# EasyEDA Pro project MP9929-BUCK电路.epro

# Schematic mp9929
Board Name: mp9929; Create Date: 2025-10-21; Page Name: P1; Project Name: mp99291; Schematic Name: mp9929; Update Date: 2025-10-21; Company: 嘉立创EDA; Page Size: A4; Version: V1.0
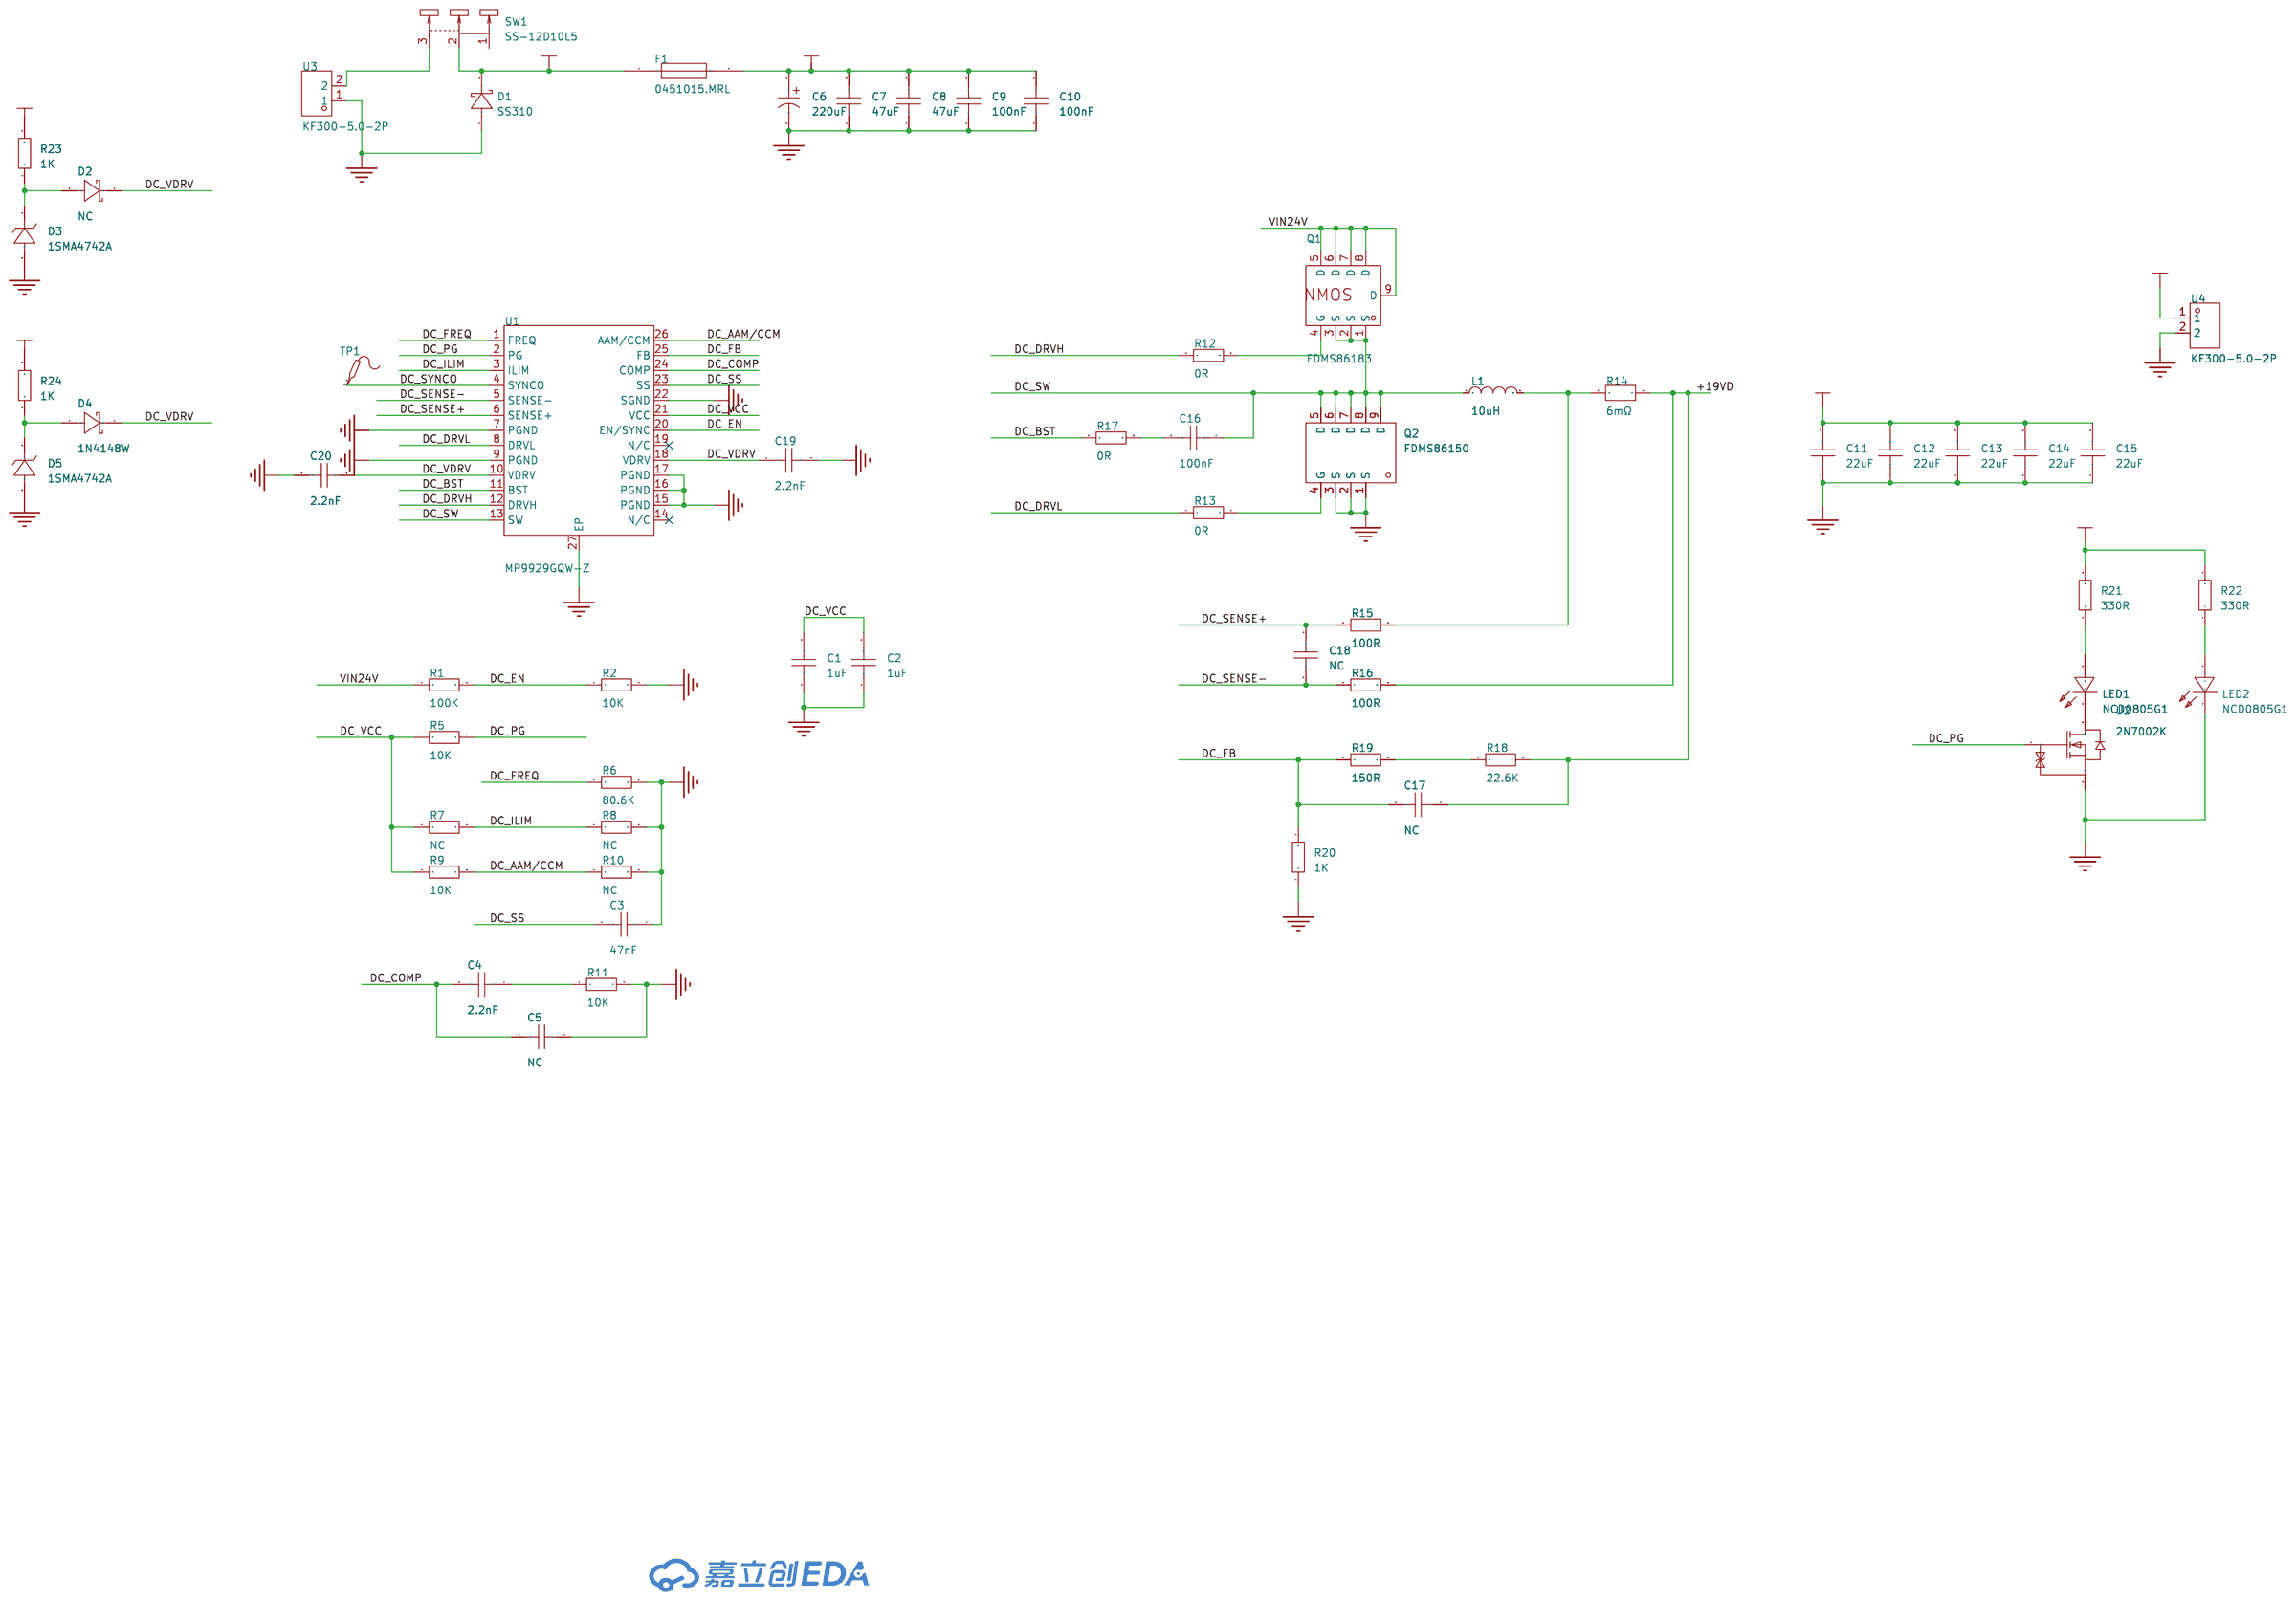
[diagram p0: schematic sheet]

## Parts
C1  1uF  [C0805]
C2  1uF  [C0805]
C3  47nF  [C0805]
C4  2.2nF  [C0805]
C5  NC  [C0805]
C6  220uF  [CAP-SMD_BD10.0-L10.3-W10.3-LS11.7-FD]
C7  47uF  [C1210]
C8  47uF  [C1210]
C9  100nF  [C0805]
C10  100nF  [C0805]
C11  22uF  [C1210]
C12  22uF  [C1210]
C13  22uF  [C1210]
C14  22uF  [C1210]
C15  22uF  [C1210]
C16  100nF  [C0805]
C17  NC  [C0805]
C18  NC  [C0805]
C19  2.2nF  [C0805]
C20  2.2nF  [C0805]
D1  SS310  [SMA_L4.3-W2.6-LS5.0-FD]
D2  NC  [SOD-123_L2.7-W1.6-LS3.7-FD]
D3  1SMA4742A  [SMA_L4.3-W2.6-LS5.0-RD]
D4  1N4148W  [SOD-123_L2.7-W1.6-LS3.7-FD]
D5  1SMA4742A  [SMA_L4.3-W2.6-LS5.0-RD]
F1  0451015.MRL  [FUSE-SMD_L6.1-W2.6]
L1  10uH  [IND-SMD_L11.5-W10.0_FXL1040]
LED1  NCD0805G1  [LED0805-R-RD]
LED2  NCD0805G1  [LED0805-R-RD]
Q1  FDMS86183  [POWER-56_L5.0-W6.0-P1.27-LS6.2-BL]
Q2  FDMS86150  [POWER-56_L5.0-W6.0-P1.27-LS6.2-BL]
R1  100K  [R0805]
R2  10K  [R0805]
R5  10K  [R0805]
R6  80.6K  [R0805]
R7  NC  [R0805]
R8  NC  [R0805]
R9  10K  [R0805]
R10  NC  [R0805]
R11  10K  [R0805]
R12  0R  [R0805]
R13  0R  [R0805]
R14  6mΩ  [RES-SMD_L6.4-W3.2-R2512]
R15  100R  [R0805]
R16  100R  [R0805]
R17  0R  [R0805]
R18  22.6K  [R0805]
R19  150R  [R0805]
R20  1K  [R0805]
R21  330R  [R0805]
R22  330R  [R0805]
R23  1K  [R0805]
R24  1K  [R0805]
SW1  SS-12D10L5  [SW-TH_SS-12D10L5]
TP1  -  [Test-Point-0.5mm]
U1  MP9929GQW-Z  [QFN-26_L6.0-W4.0-P0.50_MP9929GQW-Z]
U2  2N7002K  [SOT-23-3_L2.9-W1.3-P0.95-LS2.4-BR]
U3  KF300-5.0-2P  [CONN-TH_P5.00_KF300-5.0-2P]
U4  KF300-5.0-2P  [CONN-TH_P5.00_KF300-5.0-2P]

## Library data of the parts
C1-C5 C17 C19 C20 = CAP_0603: Supplier Footprint: 0603
C6 = JVJ50V220M10x10: 容值:220uF;精度:±20%;额定电压:50V;纹波电流:220mA@120Hz;; LCSC Part Name: 220uF ±20% 50V; Supplier Part: C46550417; Manufacturer: JIERR(捷而瑞); Supplier Footprint: SMD,D10xL10.5mm; JLCPCB Part Class: 扩展库; Datasheet: https://item.szlcsc.com/datasheet/JVJ50V220M10x10/48680111.html; Supplier: LCSC; Tolerance: ±20%; Voltage Rating: 50V; Ripple Current: 220mA@120Hz; Diameter: 10mm; Height - Seated (Max): 10.5mm; Lifetime: 2000hrs@105℃; Operating Temperature: -55℃~+105℃
C7 C8 C11-C15 = HGC1210R5476M250NSVK: 容值:47uF;精度:±20%;额定电压:25V;温度系数:X5R;; LCSC Part Name: 47uF ±20% 25V; Supplier Part: C7432791; Manufacturer: Chinocera(华瓷); Supplier Footprint: 1210; JLCPCB Part Class: 扩展库; Datasheet: https://item.szlcsc.com/datasheet/HGC1210R5476M250NSVK/8438273.html; Supplier: LCSC; Tolerance: ±20%; Voltage Rating: 25V; Temperature Coefficient: X5R
C9 C10 C16 C18 = CL10B104KB8NNNC: 容值:100nF;精度:±10%;额定电压:50V;温度系数:X7R;; LCSC Part Name: 100nF ±10% 50V; Supplier Part: C1591; Manufacturer: SAMSUNG(三星); Supplier Footprint: 0603; JLCPCB Part Class: 扩展库; Datasheet: https://item.szlcsc.com/datasheet/CL10B104KB8NNNC/1943.html; Supplier: LCSC; Tolerance: ±10%; Voltage Rating: 50V; Temperature Coefficient: X7R
D1 = SS310_C7420364: 二极管配置:独立式;正向压降(Vf):850mV@3A;直流反向耐压(Vr):100V;整流电流:3A;; LCSC Part Name: 电压:100V 电流:3A; Supplier Part: C7420364; Manufacturer: R+O(宏嘉诚); Supplier Footprint: SMA(DO-214AC); JLCPCB Part Class: 扩展库; Datasheet: https://item.szlcsc.com/datasheet/SS310/8397186.html; Supplier: LCSC; Diode Configuration: 独立式; Voltage - Forward(Vf@If): 850mV@3A; Voltage - DC Reverse(Vr): 100V; Current - Rectified: 3A; Reverse Leakage Current (Ir): 50uA@100V; Operating Junction Temperature Range: -55℃~+150℃; Non-Repetitive Peak Forward Surge Current: 80A
D2 = 1N4148W_C7420318: 二极管配置:独立式;正向压降(Vf):1.25V@150mA;直流反向耐压(Vr):100V;整流电流:150mA;反向恢复时间(Trr):4ns;; LCSC Part Name: 1N4148W; Supplier Part: C7420318; Manufacturer: R+O(宏嘉诚); Supplier Footprint: SOD-123; JLCPCB Part Class: 扩展库; Datasheet: https://item.szlcsc.com/datasheet/1N4148W/8397140.html; Supplier: LCSC; Diode Configuration: 独立式; Voltage - Forward(Vf@If): 1.25V@150mA; Voltage - DC Reverse(Vr): 100V; Current - Rectified: 150mA; Pd - Power Dissipation: 400mW; Reverse Leakage Current (Ir): 1uA@75V; Reverse Recovery Time (trr): 4ns; Operating Junction Temperature Range: -55℃~+150℃; Non-Repetitive Peak Forward Surge Current: 2A
D3 D5 = 1SMA4742A_C19077480: 二极管配置:独立式;稳压值(标称值):12V;稳压值(范围):11.4V~12.6V;耗散功率(Pd):1W;; LCSC Part Name: 独立式 耐压:12V 电流:5uA@9V; Supplier Part: C19077480; Manufacturer: R+O(宏嘉诚); Supplier Footprint: DO-214AC(SMA); JLCPCB Part Class: 扩展库; Datasheet: https://item.szlcsc.com/datasheet/1SMA4742A/20275565.html; Supplier: LCSC; Diode Configuration: 独立式; Zener Voltage(Nom): 12V; Reverse Leakage Current (Ir): 5uA@9V; Zener Voltage(Range): 11.4V~12.6V; Pd - Power Dissipation: 1W; Impedance(Zzt): 9Ω; Operating Junction Temperature Range: -55℃~+150℃
D4 = 1N4148W_C7420318: 二极管配置:独立式;正向压降(Vf):1.25V@150mA;直流反向耐压(Vr):100V;整流电流:150mA;反向恢复时间(Trr):4ns;; Supplier Part: C7420318; Manufacturer: R+O(宏嘉诚); Supplier Footprint: SOD-123; JLCPCB Part Class: 扩展库; Datasheet: https://item.szlcsc.com/datasheet/1N4148W/8397140.html; Supplier: LCSC; Diode Configuration: 独立式; Voltage - Forward(Vf@If): 1.25V@150mA; Voltage - DC Reverse(Vr): 100V; Current - Rectified: 150mA; Pd - Power Dissipation: 400mW; Reverse Leakage Current (Ir): 1uA@75V; Reverse Recovery Time (trr): 4ns; Operating Junction Temperature Range: -55℃~+150℃; Non-Repetitive Peak Forward Surge Current: 2A
F1 = 0451015.MRL: 类型:贴片式保险丝;额定电流:15A;额定电压 (AC):65V;额定电压:65V;分断能力:50A;; LCSC Part Name: 65V贴片式保险丝; Supplier Part: C44480; Manufacturer: Littelfuse(美国力特); Supplier Footprint: 2410; JLCPCB Part Class: 扩展库; Datasheet: https://item.szlcsc.com/datasheet/0451015.MRL/45482.html; Supplier: LCSC; Type: 贴片式保险丝; Current Rating: 15A; Voltage Rating (AC): 65V; Voltage Rating (DC): 65V; Operating Temperature: -55℃~+125℃; Interrupt Rating: 50A
L1 = FXL1040-100-M: 电感值:10uH;精度:±20%;额定电流:7.8A;饱和电流(Isat):8.5A;类型:一体成型电感;; LCSC Part Name: 10uH ±20% 8.5A; Supplier Part: C475915; Manufacturer: cjiang(长江微电); Supplier Footprint: SMD,11.5x10mm; JLCPCB Part Class: 扩展库; Datasheet: https://atta.szlcsc.com/upload/public/pdf/source/20240426/3189EA8206330E2108542F9E34E540E7.pdf; Supplier: LCSC; Tolerance: ±20%; Rated Current: 7.8A; Current - Saturation (Isat): 8.5A; DC Resistance (DCR): 30mΩ; Type: 一体成型电感
LED1 LED2 = NCD0805G1: 灯头类型:-;发光颜色:绿色;正向压降(Vf):2.5V~3.6V;功率:72mW;正向电流:20mA;波长:525nm~537.5nm;二极管配置:-;透镜颜色:-;色温:-;发光强度:400mcd;发光角度:130°;载带方式:-;工作温度:-30℃~+85℃;; LCSC Part Name: 片式发光二极管; Supplier Part: C84260; Manufacturer: 国星光电; Supplier Footprint: 0805; JLCPCB Part Class: 扩展库; Datasheet: https://item.szlcsc.com/datasheet/NCD0805G1/85429.html; Supplier: LCSC; Illumination Color: 绿色; Voltage - Forward(Vf): 2.5V~3.6V; Power(Watts): 72mW; Forward Current: 20mA; Wavelength - Dominant: 525nm~537.5nm; Peak Wavelength: 520nm; Luminous Intensity: 400mcd; Viewing Angle: 130°; Operating Temperature: -30℃~+85℃
Q1 = FDMS86183: 类型:-;漏源电压(Vdss):-;连续漏极电流(Id):-;功率(Pd):-;导通电阻(RDS(on)@Vgs,Id):-;阈值电压(Vgs(th)@Id):-;; LCSC Part Name: N 沟道屏蔽门极 PowerTrench MOSFET 100 V，51 A，12.8 mΩ; Supplier Part: C891093; Manufacturer: onsemi(安森美); Supplier Footprint: Power-56-8; JLCPCB Part Class: 扩展库; Datasheet: https://atta.szlcsc.com/upload/public/pdf/source/20210624/C891093_BCD16E45048C0D0D4E3284DC0FFDD818.pdf; Supplier: LCSC
Q2 = FDMS86150: 数量:1个N沟道;漏源电压(Vdss):100V;连续漏极电流(Id):80A;导通电阻(RDS(on)):7.8mΩ@6V,13A;耗散功率(Pd):156W;阈值电压(Vgs(th)):2V;; LCSC Part Name: 1个N沟道 耐压:100V 电流:80A; Supplier Part: C455161; Manufacturer: onsemi(安森美); Supplier Footprint: Power56-8; JLCPCB Part Class: 扩展库; Datasheet: https://item.szlcsc.com/datasheet/FDMS86150/457746.html; Supplier: LCSC; Number: 1个N沟道; Drain to Source Voltage: 100V; Current - Continuous Drain(Id): 80A; RDS(on): 7.8mΩ@6V,13A; Pd - Power Dissipation: 156W; Gate Threshold Voltage (Vgs(th)): 2V; Input Capacitance(Ciss): 3.055nF@50V; Reverse Transfer Capacitance (Crss@Vds): 29pF@50V; Operating Temperature: -55℃~+150℃
R1 R2 R5-R13 R15-R24 = Res_0603: Supplier Footprint: 0603
R14 = RE2512F3R006: 电阻类型:采样电阻；合金电阻;阻值:6mΩ;精度:±1%;功率:3W;温度系数:±100ppm/℃;; LCSC Part Name: 6mΩ 3W 2512 ±1%; Supplier Part: C46961751; Manufacturer: JIERR(捷而瑞); Supplier Footprint: 2512; JLCPCB Part Class: 扩展库; Datasheet: https://item.szlcsc.com/datasheet/RE2512F3R006/49133290.html; Supplier: LCSC; Type: 采样电阻；合金电阻; Tolerance: ±1%; Power(Watts): 3W; Temperature Coefficient: ±100ppm/℃
SW1 = SS-12D10L5: 电路结构:单刀双掷;安装方式:直插;开关颜色:黑色;额定电流:3A;额定电压:125V;工作寿命:1万次;; LCSC Part Name: 柄长5mm 直插双档 滑动开关; Supplier Part: C319012; Manufacturer: XKB Connection(中国星坤); Supplier Footprint: 插件,13x6.8mm; JLCPCB Part Class: 扩展库; Datasheet: https://item.szlcsc.com/datasheet/SS-12D10L5/300104.html; Supplier: LCSC; Circuit: 单刀双掷; Actuator Style: 矩形柱状; Termination Style: PC引脚; Length: 13mm; Width: 6.8mm; Switch Height: 6.4mm; Mounting Type: 直插; Actuator Color: 黑色; Current Rating: 3A; Voltage Rating: 125V; Life: 1万次; Operating Temperature: -40℃~+85℃
TP1 = Test-Point: Test Point 测试点
U1 = MP9929GQW-Z: Supplier Part: C16197344; Manufacturer: MPS(芯源); Supplier Footprint: QFN-26-EP(4x6); JLCPCB Part Class: 扩展库; Supplier: LCSC
U2 = 2N7002K_C22379475: 数量:1个N沟道;漏源电压(Vdss):60V;连续漏极电流(Id):340mA;导通电阻(RDS(on)):900mΩ@10V；1.1Ω@4.5V;耗散功率(Pd):350mW;阈值电压(Vgs(th)):1.3V@1.0mA;; LCSC Part Name: 1个N沟道 耐压:60V 电流:340mA; Supplier Part: C22379475; Manufacturer: R+O(宏嘉诚); Supplier Footprint: SOT-23; JLCPCB Part Class: 扩展库; Datasheet: https://item.szlcsc.com/datasheet/2N7002K/23902955.html; Supplier: LCSC; Number: 1个N沟道; Drain to Source Voltage: 60V; Current - Continuous Drain(Id): 340mA; RDS(on): 900mΩ@10V；1.1Ω@4.5V; Pd - Power Dissipation: 350mW; Gate Threshold Voltage (Vgs(th)): 1.3V@1.0mA; Input Capacitance(Ciss): 40pF@10V; Reverse Transfer Capacitance (Crss@Vds): 10pF@10V; Operating Temperature: -55℃~+150℃; Type: N沟道
U3 U4 = KF300-5.0-2P: 结构:1x2P;间距:5mm;颜色:蓝色;安装方式:直插;额定电流:17A;额定电压:250V;排数:1;线规 - AWG:14~22;线规 - 平方毫米:1.5;每排PIN数:2;工作温度范围:-30℃~+120℃;; LCSC Part Name: 5mm 1x2P 排数:1 每排P数:2 直插; Supplier Part: C474885; Manufacturer: KEFA(科发); Supplier Footprint: 插件,P=5mm; JLCPCB Part Class: 扩展库; Datasheet: https://atta.szlcsc.com/upload/public/pdf/source/20230317/14804D76AFF6F013C48AFFB0777F64D9.pdf; Supplier: LCSC; Structure: 1x2P; Pitch: 5mm; Color: 蓝色; Mounting Style: 直插; Current Rating (Max): 17A; Voltage Rating (Max): 250V; Number of Pins: 2P; Number of Rows: 1; Wire Gauge - AWG: 14~22; Wire Gauge - mm2: 1.5; Number of PINs Per Row: 2; Operating Temperature Range: -30℃~+120℃

## Nets
+19VD: C11.2 C12.2 C13.2 C14.2 C15.2 C17.1 R14.2 R16.2 R18.2 R21.2 R22.2 R23.2 U4.1
GND: C1.1 C2.1 C3.1 C5.1 C6.2 C7.1 C8.1 C9.1 C10.1 C11.1 C12.1 C13.1 C14.1 C15.1 C19.2 C20.1 D1.1(A) D3.2(A) D5.2(A) LED2.2(K) Q2.1(S) Q2.2(S) Q2.3(S) R2.2 R6.2 R8.2 R10.2 R11.2 R20.1 U1.7(PGND) U1.9(PGND) U1.15(PGND) U1.16(PGND) U1.17(PGND) U1.22(SGND) U1.27(EP) U2.2(S) U3.1 U4.2
VIN: D1.2(K) F1.1 SW1.2
VIN24V: C6.1 C7.2 C8.2 C9.2 C10.2 F1.2 Q1.5(D) Q1.6(D) Q1.7(D) Q1.8(D) Q1.9(D) R1.1 R24.2
DC_AAM/CCM: R9.2 R10.1 U1.26(AAM/CCM)
DC_BST: R17.1 U1.11(BST)
DC_COMP: C4.2 C5.2 U1.24(COMP)
DC_DRVH: R12.1 U1.12(DRVH)
DC_DRVL: R13.1 U1.8(DRVL)
DC_EN: R1.2 R2.1 U1.20(EN/SYNC)
DC_FB: C17.2 R19.1 R20.2 U1.25(FB)
DC_FREQ: R6.1 U1.1(FREQ)
DC_ILIM: R7.2 R8.1 U1.3(ILIM)
DC_PG: R5.2 U1.2(PG) U2.1(G)
DC_SENSE+: C18.1 R15.1 U1.6(SENSE+)
DC_SENSE-: C18.2 R16.1 U1.5(SENSE-)
DC_SS: C3.2 U1.23(SS)
DC_SW: C16.1 L1.1 Q1.1(S) Q1.2(S) Q1.3(S) Q2.5(D) Q2.6(D) Q2.7(D) Q2.8(D) Q2.9(D) U1.13(SW)
DC_SYNCO: TP1.1 U1.4(SYNCO)
DC_VCC: C1.2 C2.2 R5.1 R7.1 R9.1 U1.21(VCC)
DC_VDRV: C19.1 C20.2 D2.2(K) D4.2(K) U1.10(VDRV) U1.18(VDRV)
$1N1100: C4.1 R11.1
$1N1473: Q1.4(G) R12.2
$1N1609: Q2.4(G) R13.2
$1N1771: L1.2 R14.1 R15.2
$1N2895: C16.2 R17.2
$1N3142: R18.1 R19.2
$1N3429: SW1.3 U3.2
$1N3660: LED1.1(A) R21.1
$1N3794: LED1.2(K) U2.3(D)
$1N3867: LED2.1(A) R22.1
$1N4298: D2.1(A) D3.1(K) R23.1
$1N4311: D4.1(A) D5.1(K) R24.1

Not connected (* = marked no-connect by the designer): SW1 1; U1 14(N/C)* 19(N/C)*

# Board mp9929
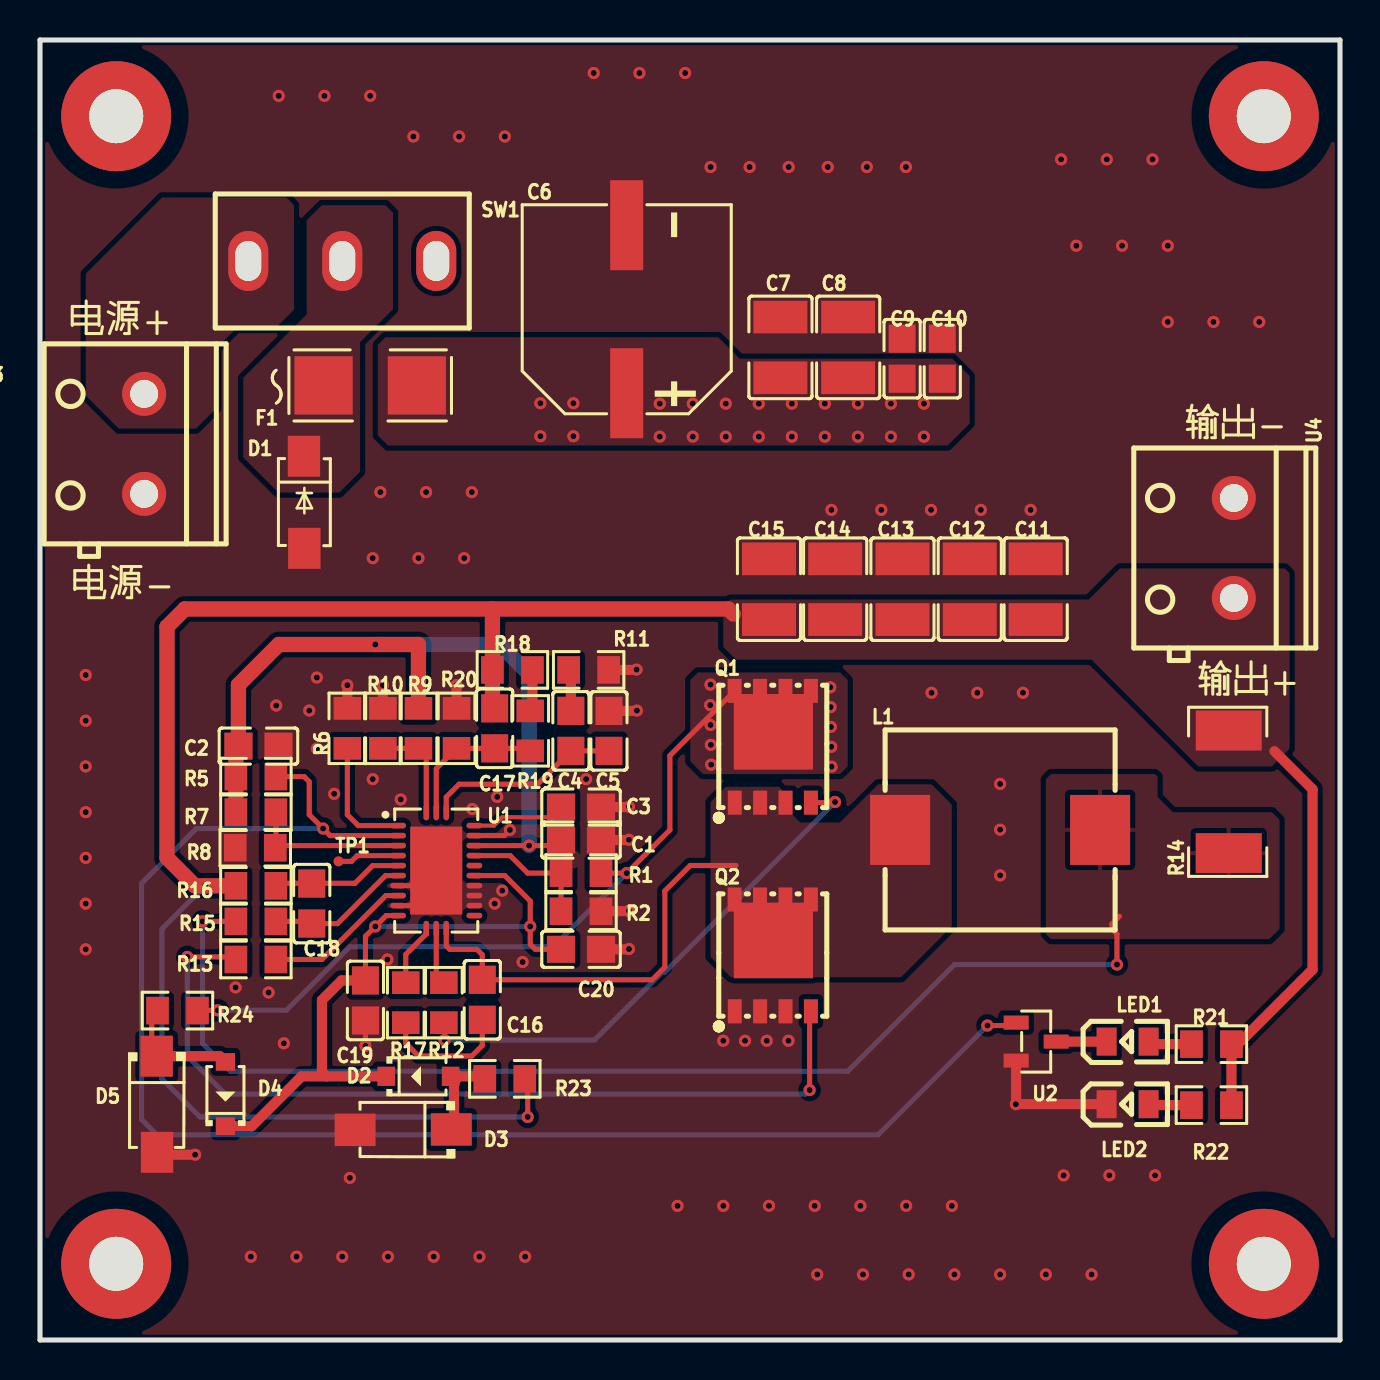
[diagram p1: board, top side]
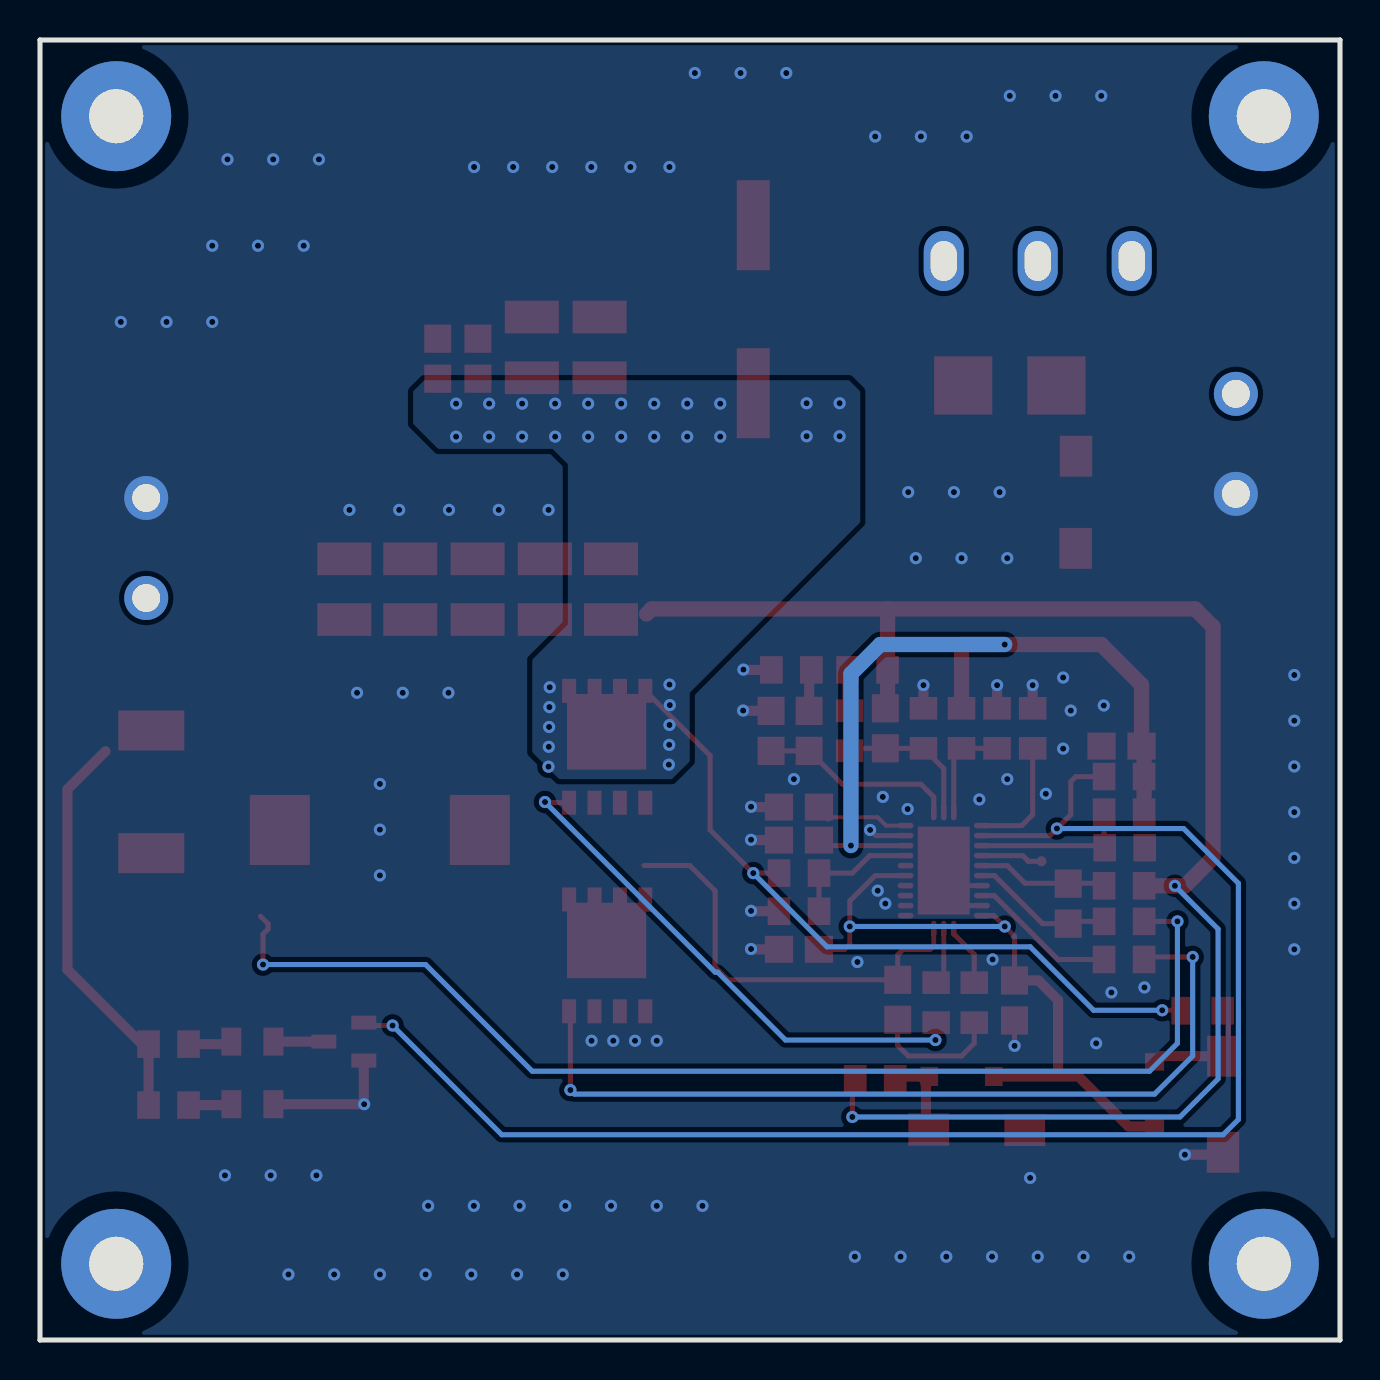
[diagram p2: board, bottom side, seen from below]

Outline 65 x 65 mm; copper layers: Top Layer, Bottom Layer. Coordinates in mm from the lower left corner of the outline.
Outline path: 0,65 0,0 65,0 65,65 0,65
Stack: Top Layer 0.035mm / Dielectric1 1.51mm FR4 er 4.5 / Bottom Layer 0.035mm

## Design rules (mm)
template: 自定义配置
spacing copperThickness1oz (default): track to track 0.102, other pairs 0.152 to 0.508
spacing copperThickness2oz: track to track 0.203, other pairs 0.152 to 0.3
track width copperThickness1oz (default): min 0.127, default 0.254, max 2.54
track width copperThickness2oz: min 0.203, default 0.254, max 2.54
differential pair differentialPair (default): width min 0.127, default 0.254, max 2.54; gap min 0.152, default 0.152
via viaSize (default): diameter min 0.5, default 0.61, max 10; hole min 0.3, default 0.305, max 6.299
net GND uses copperRegion1
net VIN24V uses copperRegion1
net +19VD uses copperRegion1
net DC_SW uses copperRegion1
net VIN uses copperRegion1
net $1N3429 uses copperRegion1

## Placement (name value [footprint] x y rotation side)
C1  1uF  [C0805]  27.05 25 180 top
C2  1uF  [C0805]  10.92 29.69 180 top
C3  47nF  [C0805]  27.05 26.65 180 top
C4  2.2nF  [C0805]  26.54 30.46 270 top
C5  NC  [C0805]  28.45 30.46 270 top
C6  220uF  [CAP-SMD_BD10.0-L10.3-W10.3-LS11.7-FD]  29.34 51.54 90 top
C7  47uF  [C1210]  37.02 49.63 270 top
C8  47uF  [C1210]  40.41 49.63 270 top
C9  100nF  [C0805]  43.1 49.07 270 top
C10  100nF  [C0805]  45.11 49.07 270 top
C11  22uF  [C1210]  49.78 37.54 270 top
C12  22uF  [C1210]  46.49 37.54 270 top
C13  22uF  [C1210]  43.12 37.54 270 top
C14  22uF  [C1210]  39.76 37.54 270 top
C15  22uF  [C1210]  36.45 37.54 270 top
C16  100nF  [C0805]  22.11 17.01 270 top
C17  NC  [C0805]  22.73 30.58 270 top
C18  NC  [C0805]  13.59 21.82 90 top
C19  2.2nF  [C0805]  16.27 16.98 270 top
C20  2.2nF  [C0805]  27.05 19.53 180 top
D1  SS310  [SMA_L4.3-W2.6-LS5.0-FD]  13.21 41.89 90 top
D2  NC  [SOD-123_L2.7-W1.6-LS3.7-FD]  18.92 13.18 180 top
D3  1SMA4742A  [SMA_L4.3-W2.6-LS5.0-RD]  18.16 10.52 180 top
D4  1N4148W  [SOD-123_L2.7-W1.6-LS3.7-FD]  9.27 12.3 270 top
D5  1SMA4742A  [SMA_L4.3-W2.6-LS5.0-RD]  5.84 11.79 270 top
F1  0451015.MRL  [FUSE-SMD_L6.1-W2.6]  16.51 47.73 0 top
L1  10uH  [IND-SMD_L11.5-W10.0_FXL1040]  48.01 25.5 0 top
LED1  NCD0805G1  [LED0805-R-RD]  54.38 14.92 0 top
LED2  NCD0805G1  [LED0805-R-RD]  54.38 11.79 0 top
NOREF  -  [Pad_e125]  61.19 3.81 180 top
NOREF#2  -  [Pad_e127]  61.19 61.19 270 top
NOREF#3  -  [Pad_e46]  3.81 61.19 0 top
NOREF#4  -  [Pad_e123]  3.81 3.81 90 top
Q1  FDMS86183  [POWER-56_L5.0-W6.0-P1.27-LS6.2-BL]  36.64 29.66 0 top
Q2  FDMS86150  [POWER-56_L5.0-W6.0-P1.27-LS6.2-BL]  36.64 19.23 0 top
R1  100K  [R0805]  27.05 23.34 180 top
R2  10K  [R0805]  27.05 21.44 0 top
R5  10K  [R0805]  10.79 28.17 0 top
R6  80.6K  [R0805]  15.37 30.58 90 top
R7  NC  [R0805]  10.79 26.39 0 top
R8  NC  [R0805]  10.76 24.61 180 top
R9  10K  [R0805]  18.92 30.58 270 top
R10  NC  [R0805]  17.15 30.58 90 top
R11  10K  [R0805]  27.43 33.5 0 top
R12  0R  [R0805]  20.19 16.87 270 top
R13  0R  [R0805]  10.79 19.03 180 top
R14  6mΩ  [RES-SMD_L6.4-W3.2-R2512]  59.44 27.41 90 top
R15  100R  [R0805]  10.79 20.93 180 top
R16  100R  [R0805]  10.79 22.71 180 top
R17  0R  [R0805]  18.29 16.87 270 top
R18  22.6K  [R0805]  23.62 33.5 180 top
R19  150R  [R0805]  24.51 30.46 90 top
R20  1K  [R0805]  20.83 30.58 270 top
R21  330R  [R0805]  58.57 14.79 0 top
R22  330R  [R0805]  58.57 11.75 0 top
R23  1K  [R0805]  23.24 13.06 0 top
R24  1K  [R0805]  6.87 16.47 0 top
SW1  SS-12D10L5  [SW-TH_SS-12D10L5]  15.11 53.95 180 top
TP1  -  [Test-Point-0.5mm]  14.93 23.93 0 top
U1  MP9929GQW-Z  [QFN-26_L6.0-W4.0-P0.50_MP9929GQW-Z]  19.81 23.47 270 top
U2  2N7002K  [SOT-23-3_L2.9-W1.3-P0.95-LS2.4-BR]  49.81 14.92 180 top
U3  KF300-5.0-2P  [CONN-TH_P5.00_KF300-5.0-2P]  5.21 44.81 270 top
U4  KF300-5.0-2P  [CONN-TH_P5.00_KF300-5.0-2P]  59.69 39.6 270 top

## Footprints (pads in the part's own frame, mm; a bottom-side part is the same pattern mirrored in y, then rotated)
C0805
  rect 1.41x1.35 smd: 1(-1,0) 2(1,0)
C1210
  rect 1.635x2.7 smd: 1(-1.518,0) 2(1.518,0)
CAP-SMD_BD10.0-L10.3-W10.3-LS11.7-FD
  rect 4.5x1.65 smd: 1(-4.2,0) 2(4.2,0)
CONN-TH_P5.00_KF300-5.0-2P
  round 2.2 hole 1.4: 1(2.5,0) 2(-2.5,0)
FUSE-SMD_L6.1-W2.6
  rect 2.91x2.91 smd: 1(-2.33,0) 2(2.33,0)
IND-SMD_L11.5-W10.0_FXL1040
  rect 3x3.5 smd: 1(-5,0) 2(5,0)
LED0805-R-RD
  rect 1x1.399 smd: 1(1.05,0) 2(-1.05,0)
Pad_e46
  round 5.5 hole 2.7: 1(0,0)
Pad_e123
  round 5.5 hole 2.7: 1(0,0)
Pad_e125
  round 5.5 hole 2.7: 1(0,0)
Pad_e127
  round 5.5 hole 2.7: 1(0,0)
POWER-56_L5.0-W6.0-P1.27-LS6.2-BL
  rect 0.7x1.2 smd: 1(-1.903,-2.796) 2(-0.633,-2.796) 3(0.636,-2.796) 4(1.907,-2.796) 5(1.903,2.796) 6(0.633,2.796) 7(-0.636,2.796) 8(-1.907,2.796)
  rect 3.96x3.78 smd: 9(0.032,0.748)
QFN-26_L6.0-W4.0-P0.50_MP9929GQW-Z
  oval 0.28x0.79 smd: 1(-2.25,-1.907) 2(-1.75,-1.907) 3(-1.25,-1.907) 4(-0.75,-1.907) 5(-0.25,-1.907) 6(0.25,-1.907) 7(0.75,-1.907) 8(1.25,-1.907) 9(1.75,-1.907) 10(2.25,-1.907) 14(2.25,1.907) 15(1.75,1.907) 16(1.25,1.907) 17(0.75,1.907) 18(0.25,1.907) 19(-0.25,1.907) 20(-0.75,1.907) 21(-1.25,1.907) 22(-1.75,1.907) 23(-2.25,1.907)
  oval 0.79x0.28 smd: 11(2.908,-0.5) 12(2.908,0) 13(2.908,0.5) 24(-2.908,0.5) 25(-2.908,0) 26(-2.908,-0.5)
  rect 4.4x2.6 smd: 27(0,0)
R0805
  rect 1.133x1.377 smd: 1(-1,0) 2(1,0)
RES-SMD_L6.4-W3.2-R2512
  rect 2x3.3 smd: 1(-3.067,0) 2(3.067,0)
SMA_L4.3-W2.6-LS5.0-FD
  rect 2.046x1.62 smd: 1(-2.304,-0.009) 2(2.304,0.009)
SMA_L4.3-W2.6-LS5.0-RD
  rect 2.046x1.62 smd: 1(-2.404,-0.009) 2(2.404,0.009)
SOD-123_L2.7-W1.6-LS3.7-FD
  rect 0.88x0.96 smd: 1(-1.61,0) 2(1.61,0)
SOT-23-3_L2.9-W1.3-P0.95-LS2.4-BR
  rect 1.25x0.7 smd: 1(1,-0.95) 2(1,0.95) 3(-1,0)
SW-TH_SS-12D10L5
  oval 2x3 hole 1.3x2: 1(-4.7,0) 2(0,0) 3(4.7,0)
Test-Point-0.5mm
  round 0.5 smd: 1(0,0)

## Nets
As in the schematic.

Pads without a net: NOREF 1; NOREF#2 1; NOREF#3 1; NOREF#4 1; SW1 1; U1 14 19

## Via types
v1: diameter 0.61, hole 0.305, Top Layer to Bottom Layer, 155 vias

## Routing (per net, layer and track width the routed paths; a pad name or vN(x,y) marks a point on that pad's centre or on a via; arc(x,y) is an arc through that point)
+19VD: length 101.1
  Top Layer w0.254: R23.2 24.38,12.91 v1(24.38,11.15)
  Top Layer w0.508: R22.2 59.57,14.46 63.63,18.52 63.63,27.53 61.72,29.44
  Top Layer w0.762: C17.1 22.62,31.69 R18.2 22.62,36.55 ; R16.2 v1(8.25,22.71) 7.75,22.71 6.35,24.11 6.35,35.66 7.24,36.55 22.62,36.55 ; 22.62,36.55 34.42,36.55 34.67,36.3
  Bottom Layer w0.254: v1(8.25,22.71) 6.1,20.55 6.1,13.06 8,11.15 24.13,11.15 24.26,11.03
GND: length 27.9
  Top Layer w0.254: U1.7 19.06,22.72 U1.27 ; 19.81,21.69 19.78,21.72 U1.9 ; C19.2 v1(16.27,14.71) ; v1(23.5,25.5) 23.21,25.22 U1.22
  Top Layer w0.508: R20.1 v1(20.83,32.74) ; v1(7.76,9.27) 5.97,9.27 D5.2 ; v1(29.83,33.52) 29.81,33.5 R11.2 ; C20.1 29.43,19.53 v1(29.45,19.55) ; v1(29.84,31.47) 29.83,31.46 C5.1 ; C1.1 29.43,25 v1(29.45,25.01) ; U2.2 48.81,11.81 v1(48.79,11.79) LED2.2 ; R2.2 29.43,21.44 v1(29.45,21.45) ; v1(29.45,26.66) 29.43,26.65 C3.1 ; R10.2 v1(17.15,32.74) ; R6.2 v1(15.37,32.74)
  vias: v1(2.29,33.25) v1(2.29,30.96) v1(2.29,28.68) v1(2.29,26.39) v1(2.29,24.11) v1(2.29,21.82) v1(2.29,19.53) v1(9.78,17.63) v1(10.54,4.17) v1(11.43,17.38) v1(11.81,31.73) v1(11.94,62.21) v1(12.19,14.83) v1(12.83,4.17) v1(13.46,31.47) v1(13.84,33.12) v1(13.84,29.57) v1(14.22,62.21) v1(14.71,27.31) v1(15.11,4.17) v1(15.49,8.1) v1(16.51,62.21) v1(16.64,39.09) v1(16.64,28.04) v1(17.02,42.39) v1(17.37,19.03) v1(17.4,4.17) v1(18.03,27.03) v1(18.67,60.17) v1(18.92,39.09) v1(19.3,42.39) v1(19.69,4.17) v1(20.96,60.17) v1(21.21,39.09) v1(21.59,42.39) v1(21.62,26.55) v1(21.97,4.17) v1(22.73,21.82) v1(22.86,27.15) v1(23.11,22.47) v1(23.24,60.17) v1(24.13,18.9) v1(24.26,4.17) v1(27.31,28.04) v1(27.69,63.35) v1(29.97,63.35) v1(31.88,6.71) v1(32.26,63.35) v1(33.53,58.65) v1(34.16,14.96) v1(34.16,6.71) v1(35.25,14.96) v1(35.48,58.65) v1(36.34,14.96) v1(36.45,6.71) v1(37.44,58.65) v1(37.42,14.96) v1(38.74,6.71) v1(38.86,3.28) v1(39.39,58.65) v1(39.57,41.5) v1(41.02,6.71) v1(41.15,3.28) v1(41.34,58.65) v1(42.06,41.5) v1(43.3,58.65) v1(43.31,6.71) v1(43.43,3.28) v1(44.55,41.5) v1(44.58,32.36) v1(45.59,6.71) v1(45.72,3.28) v1(46.86,32.36) v1(47.04,41.5) v1(48.01,27.8) v1(48.01,25.52) v1(48.01,23.23) v1(48.01,3.28) v1(49.15,32.36) v1(49.53,41.5) v1(50.29,3.28) v1(51.05,59.03) v1(51.18,8.23) v1(51.82,54.71) v1(52.58,3.28) v1(53.34,59.03) v1(53.47,8.23) v1(54.1,54.71) v1(55.63,59.03) v1(55.75,8.23) v1(56.39,54.71) v1(56.39,50.9) v1(58.67,50.9) v1(60.96,50.9)
VIN24V: length 37
  Top Layer w0.254: R24.2 7.89,16.49 v1(8.89,16.49) ; R1.1 v1(29.34,23.34) 31.5,25.5 31.5,29.22 Q1.8
  Top Layer w0.508: 33.49,32.74 33.51,32.75
  Bottom Layer w0.254: v1(8.89,16.49) 12.32,16.49 15.49,19.66 25.65,19.66 v1(29.34,23.34)
  vias: v1(25.02,46.84) v1(25.02,45.19) v1(26.67,46.84) v1(26.67,45.19) v1(30.99,46.82) v1(30.99,45.17) v1(32.64,46.82) v1(32.64,45.17) v1(33.53,32.77) v1(33.51,31.75) v1(33.53,30.75) v1(33.54,29.76) v1(33.56,28.77) v1(34.29,46.82) v1(34.29,45.17) v1(35.94,46.82) v1(35.94,45.17) v1(37.59,46.82) v1(37.59,45.17) v1(39.24,46.82) v1(39.24,45.17) v1(39.51,32.64) v1(39.53,31.64) v1(39.54,30.65) v1(39.56,29.66) v1(39.58,28.67) v1(40.89,46.82) v1(40.89,45.17) v1(42.54,46.82) v1(42.54,45.17) v1(44.2,46.82) v1(44.2,45.17)
DC_AAM/CCM: length 5.1
  Top Layer w0.254: U1.26 19.31,29.19 R9.2 R10.1
DC_COMP: length 9.9
  Top Layer w0.254: C5.2 C4.2 24.88,27.79 20.96,27.79 20.31,27.15 U1.24
DC_DRVH: length 2.8
  Top Layer w0.254: 20.19,17.94 19.81,18.32 U1.12
DC_DRVL: length 7.4
  Top Layer w0.254: R13.1 14.1,19.03 17.29,22.22 U1.8
DC_EN: length 6.6
  Top Layer w0.254: R2.1 R1.2 24.38,23.34 23.51,24.22 U1.20
DC_FB: length 7.4
  Top Layer w0.254: R19.1 24.38,29.58 C17.2 R20.2 19.81,28.57 U1.25
DC_FREQ: length 6.1
  Top Layer w0.254: U1.1 15.91,25.72 15.37,26.27 R6.1
DC_ILIM: length 7.9
  Top Layer w0.254: R8.1 11.79,24.65 ; 11.79,24.65 R7.2 ; 11.79,24.65 11.87,24.72 U1.3
DC_PG: length 76.7
  Top Layer w0.254: U2.1 48.66,15.72 v1(47.37,15.72) ; R5.2 13.21,28.17 13.46,27.92 13.46,26.27 v1(14.15,25.57) 14.51,25.22 U1.2
  Bottom Layer w0.254: v1(47.37,15.72) 41.91,10.26 5.84,10.26 5.08,11.03 5.08,22.84 7.82,25.57 v1(14.15,25.57)
DC_SENSE+: length 7.1
  Top Layer w0.254: U1.6 17.28,23.22 14.88,20.82 C18.1 ; 13.59,20.93 R15.1
DC_SENSE-: length 6.5
  Top Layer w0.254: U1.5 16.63,23.72 15.75,22.84 11.92,22.84 R16.1
DC_SS: length 4.1
  Top Layer w0.203: U1.23 22.7,25.72 23.11,26.14 25.46,26.14 25.59,26.01
DC_SW: length 21.1
  Top Layer w0.254: U1.13 20.31,19.71 20.49,19.53 21.84,19.53 22.11,19.26 22.11,18.31 ; C16.1 30.61,18.01 31.24,18.64 31.24,22.45 32.51,23.72 34.8,23.72
DC_SYNCO: length 3.1
  Top Layer w0.254: U1.4 15.86,24.22 15.58,23.93 TP1.1
DC_VCC: length 40.8
  Top Layer w0.254: C1.2 25.78,24.72 v1(24.45,24.72) U1.21
  Top Layer w0.762: R9.1 18.92,34.77 v1(16.76,34.77) 11.94,34.77 9.92,32.76 C2.2 9.79,29.57 R5.1 R7.1
  Bottom Layer w0.762: v1(24.45,24.72) 24.45,33.31 22.99,34.77 v1(16.76,34.77)
DC_VDRV: length 34.6
  Top Layer w0.254: 16.27,18.06 16.27,20.19 17.31,21.22 U1.10 ; C20.2 24.76,19.53 24.51,19.79 v1(24.51,20.68) 24.51,21.95 23.24,23.22 U1.18
  Top Layer w0.508: C19.1 15.08,17.98 14.1,16.99 14.1,13.41 14.32,13.18 ; 14.32,13.18 13.08,13.18 10.58,10.69 D4.2 ; 14.32,13.18 D2.2
  Bottom Layer w0.254: v1(16.76,20.68) v1(24.51,20.68)
$1N1100: length 2.1
  Top Layer w0.508: C4.1 26.54,33.39 R11.1
$1N1473: length 26.6
  Top Layer w0.254: R12.2 20.23,15.83 v1(20.23,15) ; v1(39.75,26.9) 39.72,26.87 38.55,26.87
  Bottom Layer w0.254: v1(39.75,26.9) 31.24,18.39 31.12,18.39 27.72,15 v1(20.23,15)
$1N1609: length 43.4
  Top Layer w0.254: Q2.4 38.48,16.37 v1(38.48,12.5) ; v1(7.37,19.15) 9.67,19.15 R13.2
  Bottom Layer w0.254: v1(38.48,12.5) 38.28,12.3 9.27,12.3 7.37,14.2 v1(7.37,19.15)
$1N1771: length 58.9
  Top Layer w0.254: R15.2 v1(8.13,20.93) ; 53.97,21.19 53.59,20.8 53.59,20.55 53.85,20.3 v1(53.85,18.77)
  Bottom Layer w0.254: v1(53.85,18.77) 45.72,18.77 40.39,13.44 9.53,13.44 8.13,14.83 v1(8.13,20.93)
$1N2895: length 6.6
  Top Layer w0.254: R17.2 18.29,14.83 18.92,14.2 21.59,14.2 22.11,14.72 C16.2
$1N3142: length 2.1
  Top Layer w0.508: R19.2 24.62,31.57 R18.1
$1N3660: length 2.4
  Top Layer w0.508: 57.82,14.79 55.56,14.79 LED1.1
$1N3794: length 2.5
  Top Layer w0.508: LED1.2 U2.3
$1N3867: length 2.4
  Top Layer w0.508: LED2.1 55.48,11.75 57.82,11.75
$1N4298: length 4.7
  Top Layer w0.508: 20.95,13.18 20.7,12.93 20.7,10.64 21.07,10.27 ; 20.95,13.18 22.11,13.18 ; 20.95,13.18 20.53,13.18
$1N4311: length 5.5
  Top Layer w0.254: 5.59,14.71 5.59,16.67
  Top Layer w0.508: D4.1 8.99,14.19 D5.1
DC_BST: length 3.4
  Top Layer w0.254: R17.1 18.29,19.28 18.67,19.66 ; U1.11 19.31,20.3 18.48,19.47

## Copper pours and planes (outline as drawn; the poured copper is in the pictures)
+19VD on Top Layer: 34.16,36.67 34.16,34.65 34.8,34.01 52.58,34.01 57.91,28.68 61.59,28.68 62.48,29.57 62.48,38.33 62.23,38.58 54,38.58 52.43,37.02 34.52,37.02
GND on Top Layer: 32.89,17.12 32.89,15.09 33.53,14.45 37.59,14.45 37.85,14.71 37.85,17.12 37.72,17.25 33.02,17.25
GND on Top Layer: 35.25,38.32 51.42,38.32 51.82,38.71 51.82,42.5 50.87,43.28 35.43,43.28 34.67,42.52 34.67,38.9
GND on Top Layer: 23.37,22.84 21.46,22.84 21.34,22.71 21.34,21.69 21.46,21.57 23.24,21.57 23.37,21.69
GND on Top Layer: -1.27,68.94 -1.27,-0.28 2.16,-3.71 64.26,-3.71 68.58,0.61 68.58,39.22 68.2,39.6 68.2,68.68 67.31,69.57 -0.64,69.57
GND on Bottom Layer: -2.16,66.14 -2.16,-1.17 -0.25,-3.07 65.28,-3.07 68.96,0.61 68.96,66.27 63.88,71.35 3.05,71.35
VIN on Top Layer: 10.16,56.75 17.65,56.75 17.65,42.37 10.16,42.37
VIN24V on Top Layer: 16.89,50.14 46.48,50.14 46.48,44.72 16.89,44.72
VIN24V on Top Layer: 32.51,33.38 40.39,33.38 40.39,28.3 32.51,28.3
VIN24V on Bottom Layer: 23.99,47.43 23.99,40.88 32.51,32.36 32.51,28.93 33.4,28.04 39.04,28.04 40.39,29.39 40.39,34.01 38.61,35.79 38.61,43.79 39.37,44.55 45.09,44.55 46.35,45.81 46.35,47.43 45.79,47.99 24.55,47.99
DC_SW on Top Layer: 34.29,27.66 33.53,26.9 33.53,19.15 34.54,18.14 43.05,18.14 45.59,20.68 45.59,26.77 44.58,27.79 41.91,27.79 40,25.88 38.01,25.88 37.62,26.27 37.62,26.99 36.96,27.66
$1N1771 on Top Layer: 50.29,28.04 50.29,20.3 50.55,20.04 61.47,20.04 61.98,20.55 61.98,26.01 61.59,26.39 56.64,26.39 55.88,27.15 55.88,28.17 55.75,28.3 50.55,28.3
$1N3429 on Top Layer: 2.29,47.22 3.94,45.57 7.8,45.57 8.82,46.59 8.82,49.58 9.83,50.6 11.78,50.6 12.7,51.52 12.7,56.75 12.32,57.13 6.1,57.13 2.29,53.32

## Text on the board
Top Silkscreen Layer: 电源+ | 电源- | 输出- | 输出+
